# EAGLE design A6SS-4 (EAGLE 7.5.0)

## Sheet 1 of 4: SS-read
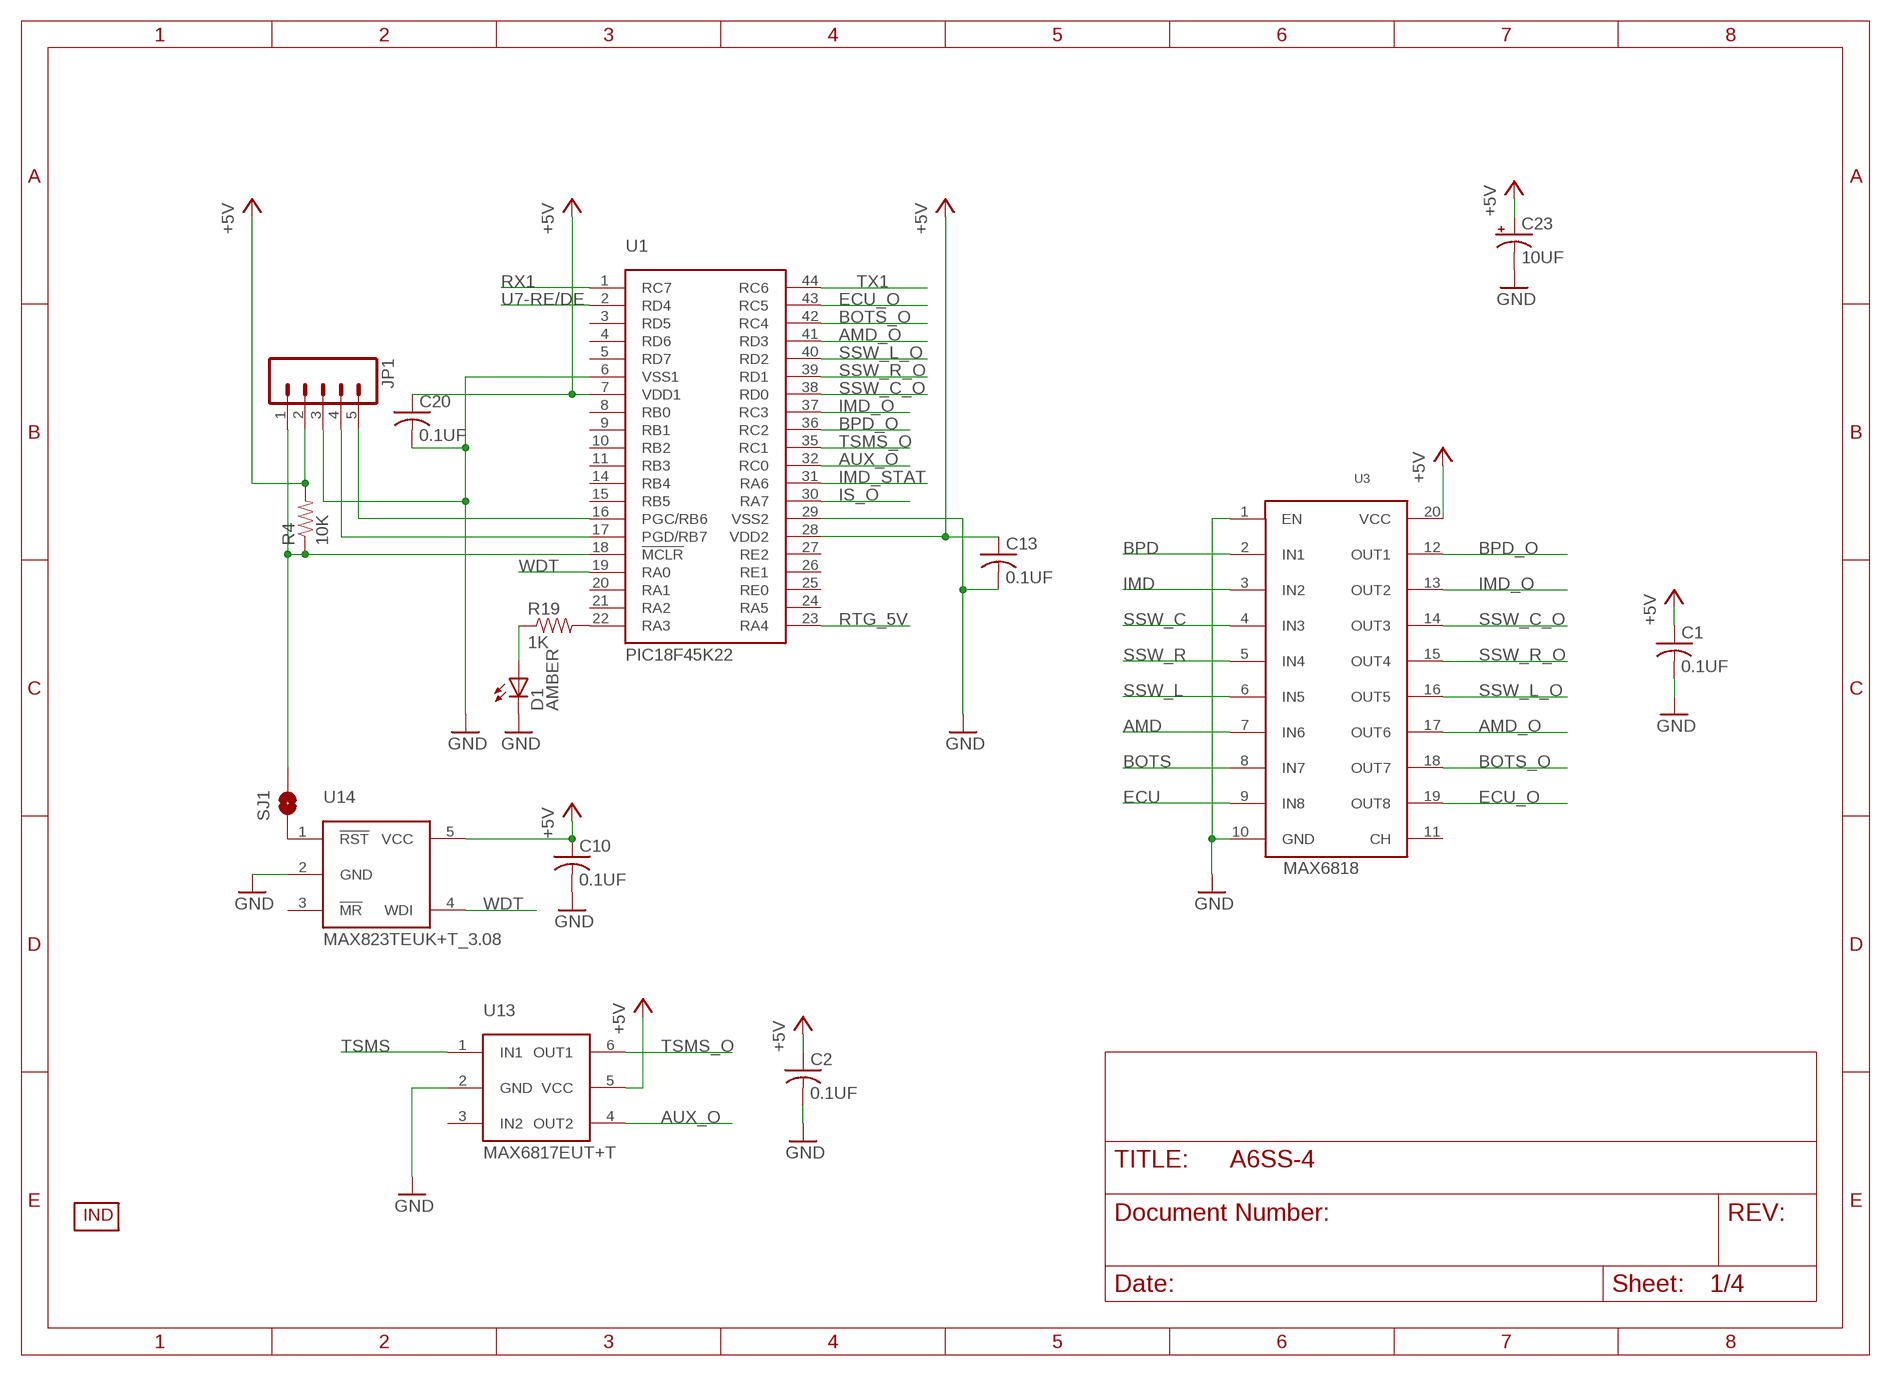
[diagram p0: schematic, sheet 1]

### Parts
C1  0.1UF  CAP_0.1UF_50V_0805  [0805]
C2  0.1UF  CAP_0.1UF_50V_0805  [0805]
C10  0.1UF  CAP_0.1UF_50V_0805  [0805]
C13  0.1UF  CAP_0.1UF_50V_0805  [0805]
C20  0.1UF  CAP_0.1UF_50V_0805  [0805]
C23  10UF  CAP-POL_10UF_16V  [EIA3216-16V]
D1  AMBER  LED_AMBER  [CHIP_LED0805]
JP1  M05LOCK_LONGPADS  [1X05_LOCK_LONGPADS]
R4  10K  RES_10K_1%_0805  [0805]
R19  1K  RES_1K_1%_0805  [0805]
SJ1  SOLDERJUMPERNO  [SJ_2S-NO]
U1  PIC18F45K22  [TQFP-44]
U3  MAX6818  [SSOP-20]
U13  MAX6817EUT+T  [SOT23-6]
U14  MAX823TEUK+T_3.08  [SOT23-5]
U$1  INDPK1  [PICKIT-PIN-1]

### Nets
+5V: C1.1(+) C2.1(+) C10.1(+) C13.1(+) C20.1(+) C23.A(+) JP1.2 R4.2 U1.7(VDD1) U1.28(VDD2) U3.20(VCC) U13.5(VCC) U14.5(VCC) ; also sheet 2,3,4
AMD: U3.7(IN6) ; also sheet 4
AMD_O: U1.41(RD3) U3.17(OUT6)
AUX_O: U1.32(RC0) U13.4(OUT2)
BOTS: U3.8(IN7) ; also sheet 4
BOTS_O: U1.42(RC4) U3.18(OUT7)
BPD: U3.2(IN1) ; also sheet 4
BPD_O: U1.36(RC2) U3.12(OUT1)
ECU: U3.9(IN8) ; also sheet 4
ECU_O: U1.43(RC5) U3.19(OUT8)
GND: C1.2(-) C2.2(-) C10.2(-) C13.2(-) C20.2(-) C23.C(-) D1.C JP1.3 U1.6(VSS1) U1.29(VSS2) U3.1(EN) U3.10(GND) U13.2(GND) U14.2(GND) ; also sheet 2,3,4
IMD: U3.3(IN2) ; also sheet 4
IMD_O: U1.37(RC3) U3.13(OUT2)
IMD_STAT: U1.31(RA6) ; also sheet 3
IS_O: U1.30(RA7) ; also sheet 4
N$1: SJ1.1 U14.1(!RST)
N$16: D1.A R19.1
N$20: R19.2 U1.22(RA3)
N$40: JP1.4 U1.17(PGD/RB7)
N$43: JP1.5 U1.16(PGC/RB6)
N$46: JP1.1 R4.1 SJ1.2 U1.18(!MCLR)
RTG_5V: U1.23(RA4) ; also sheet 2
RX1: U1.1(RC7) ; also sheet 4
SSW_C: U3.4(IN3) ; also sheet 4
SSW_C_O: U1.38(RD0) U3.14(OUT3)
SSW_L: U3.6(IN5) ; also sheet 4
SSW_L_O: U1.40(RD2) U3.16(OUT5)
SSW_R: U3.5(IN4) ; also sheet 4
SSW_R_O: U1.39(RD1) U3.15(OUT4)
TSMS: U13.1(IN1) ; also sheet 4
TSMS_O: U1.35(RC1) U13.6(OUT1)
TX1: U1.44(RC6) ; also sheet 4
U7-RE/DE: U1.2(RD4) ; also sheet 4
WDT: U1.19(RA0) U14.4(WDI)
Unconnected: U1.3(RD5) U1.4(RD6) U1.5(RD7) U1.8(RB0) U1.9(RB1) U1.10(RB2) U1.11(RB3) U1.14(RB4) U1.15(RB5) U1.20(RA1) U1.21(RA2) U1.24(RA5) U1.25(RE0) U1.26(RE1) U1.27(RE2) U3.11(CH) U13.3(IN2) U14.3(!MR)

## Sheet 2 of 4: PRE charge
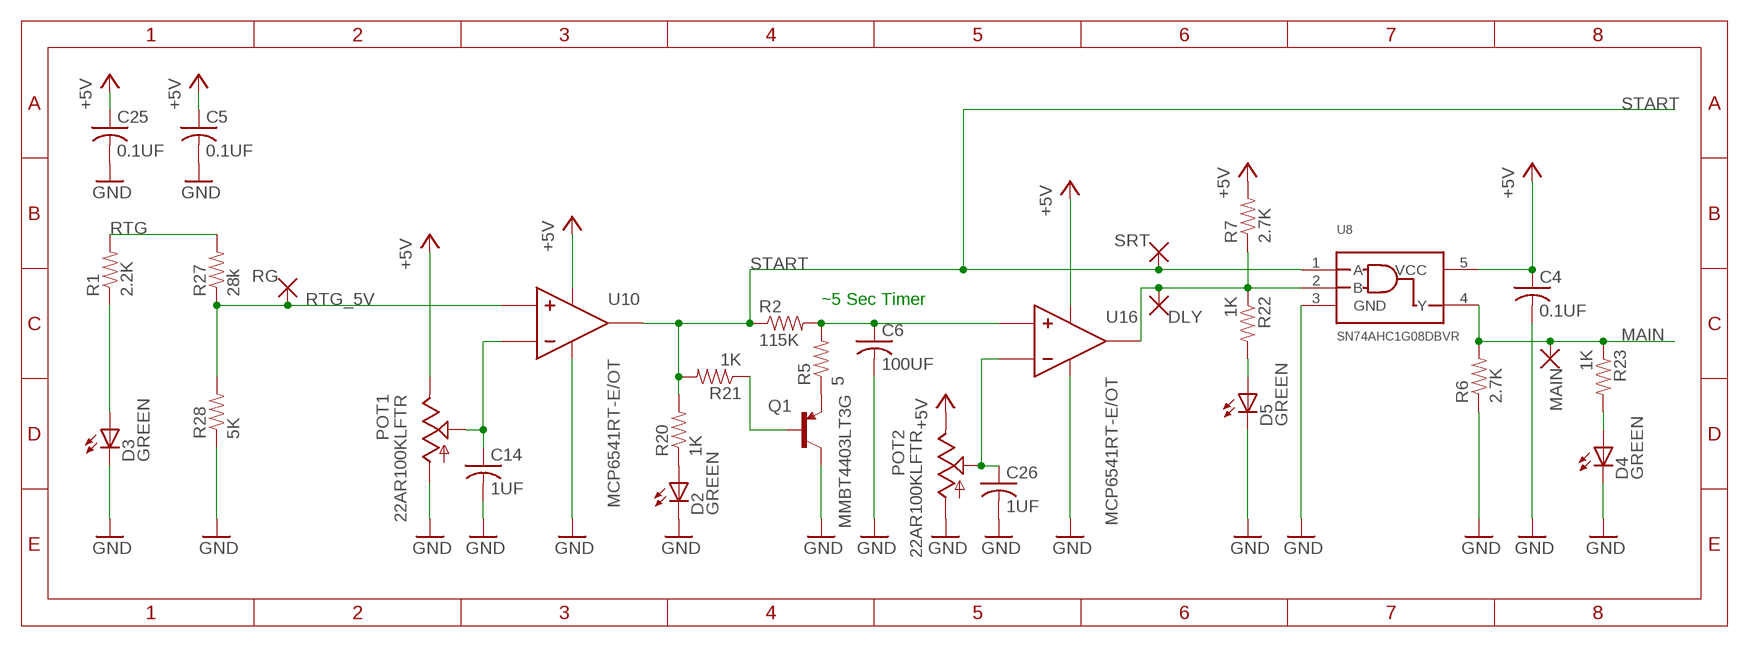
[diagram p1: schematic, sheet 2]

### Parts
C4  0.1UF  CAP_0.1UF_50V_0805  [0805]
C5  0.1UF  CAP_0.1UF_50V_0805  [0805]
C6  100UF  CAP_100UF_6.3V  [1206]
C14  1UF  CAP_1UF_50V_0805  [0805]
C25  0.1UF  CAP_0.1UF_50V_0805  [0805]
C26  1UF  CAP_1UF_50V_0805  [0805]
D2  GREEN  LED_GREEN  [CHIP_LED0805]
D3  GREEN  LED_GREEN  [CHIP_LED0805]
D4  GREEN  LED_GREEN  [CHIP_LED0805]
D5  GREEN  LED_GREEN  [CHIP_LED0805]
DLY  TP  [0603]
MAIN  TP  [0603]
POT1  22AR100KLFTR  [22AR100KLFTR]
POT2  22AR100KLFTR  [22AR100KLFTR]
Q1  MMBT4403LT3G  PNP_MMBT4403LT3G  [SOT23]
R1  2.2K  RES_2.2K_1%_0805  [0805]
R2  115K  RES_115K_1%_0805  [0805]
R5  5  RES_5_5%_0805  [0805]
R6  2.7K  RES_2.7K_5%_0805  [0805]
R7  2.7K  RES_2.7K_5%_0805  [0805]
R20  1K  RES_1K_1%_0805  [0805]
R21  1K  RES_1K_1%_0805  [0805]
R22  1K  RES_1K_1%_0805  [0805]
R23  1K  RES_1K_1%_0805  [0805]
R27  28k  RES_28K_1%  [0805]
R28  5K  RES_5K_0.1%  [0805]
RG  TP  [0603]
SRT  TP  [0603]
U8  SN74AHC1G08DBVR  [SOT23-5]
U10  MCP6541RT-E/OT  [SOT23-5]
U16  MCP6541RT-E/OT  [SOT23-5]

### Nets
+5V: C4.1(+) C5.1(+) C25.1(+) POT1.1(CCW) POT2.1(CCW) R7.2 U8.5(VCC) U10.2(VDD) U16.2(VDD) ; also sheet 1,3,4
GND: C4.2(-) C5.2(-) C6.2(-) C14.2(-) C25.2(-) C26.2(-) D2.C D3.C D4.C D5.C POT1.3(CW) POT2.3(CW) Q1.3(C) R6.1 R28.1 U8.3(GND) U10.5(GND) U16.5(GND) ; also sheet 1,3,4
MAIN: MAIN.1 MAIN.2 R6.2 R23.1 U8.4(Y) ; also sheet 4
N$3: C26.1(+) POT2.2(W) U16.4(-)
N$5: Q1.1(B) R21.1
N$6: Q1.2(E) R5.1
N$11: C14.1(+) POT1.2(W) U10.4(-)
N$27: D2.A R20.1
N$33: D3.A R1.1
N$59: C6.1(+) R2.2 R5.2 U16.3(+)
N$62: DLY.1 DLY.2 R7.1 R22.1 U8.2(B) U16.1(VOUT)
N$63: D4.A R23.2
N$67: D5.A R22.2
RTG: R1.2 R27.2 ; also sheet 4
RTG_5V: R27.1 R28.2 RG.1 RG.2 U10.3(+) ; also sheet 1
START: R2.1 R20.2 R21.2 SRT.1 SRT.2 U8.1(A) U10.1(VOUT) ; also sheet 4

### Notes on the sheet
- ~5 Sec Timer

## Sheet 3 of 4
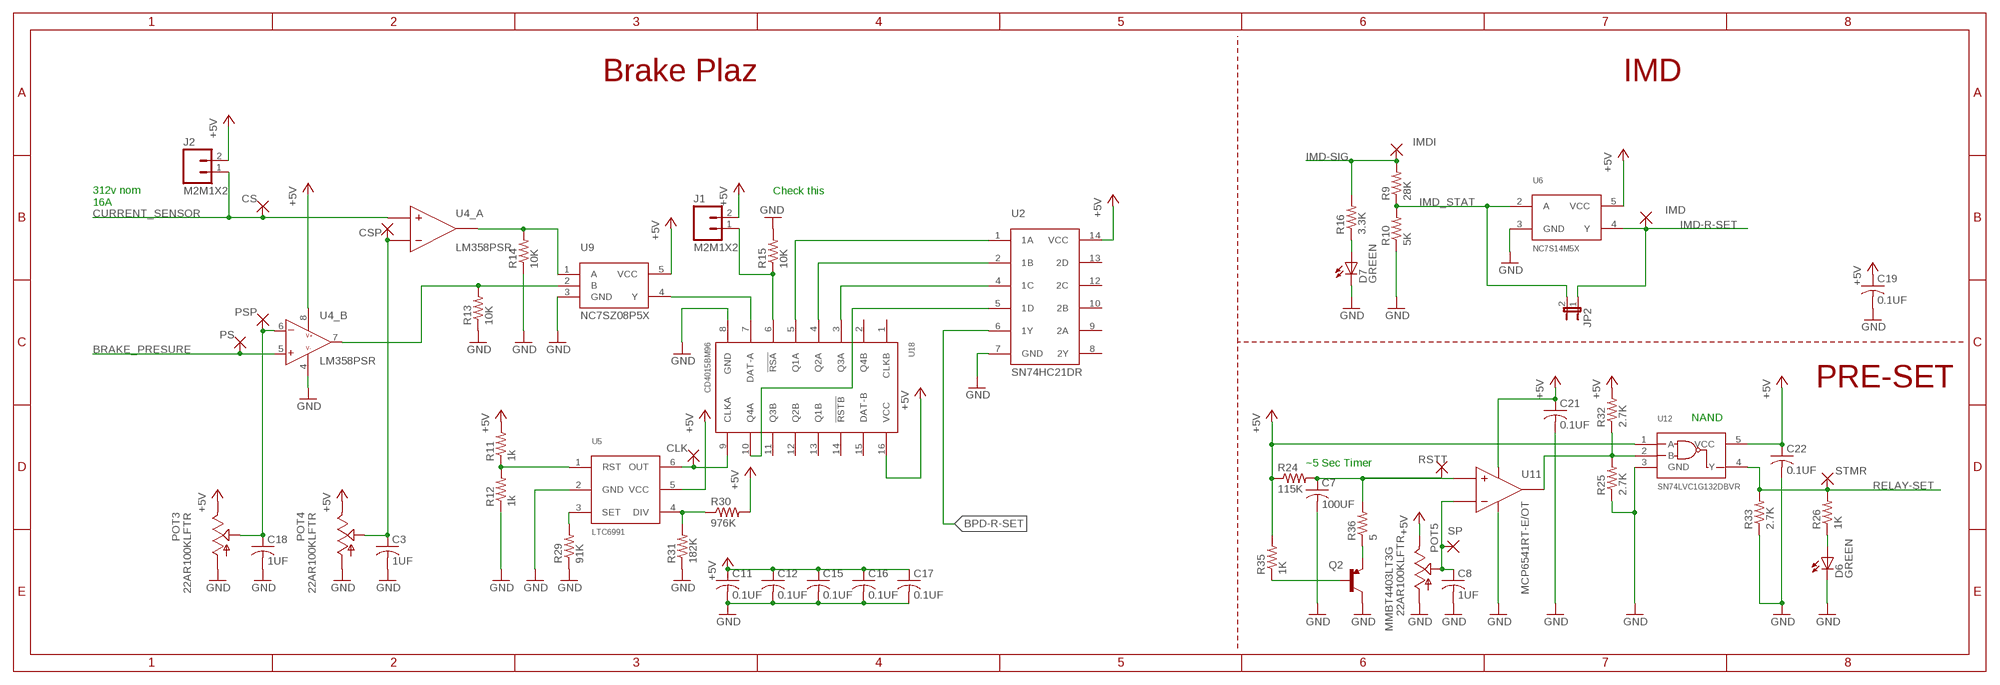
[diagram p2: schematic, sheet 3]

### Parts
C3  1UF  CAP_1UF_50V_0805  [0805]
C7  100UF  CAP_100UF_6.3V  [1206]
C8  1UF  CAP_1UF_50V_0805  [0805]
C11  0.1UF  CAP_0.1UF_50V_0805  [0805]
C12  0.1UF  CAP_0.1UF_50V_0805  [0805]
C15  0.1UF  CAP_0.1UF_50V_0805  [0805]
C16  0.1UF  CAP_0.1UF_50V_0805  [0805]
C17  0.1UF  CAP_0.1UF_50V_0805  [0805]
C18  1UF  CAP_1UF_50V_0805  [0805]
C19  0.1UF  CAP_0.1UF_50V_0805  [0805]
C21  0.1UF  CAP_0.1UF_50V_0805  [0805]
C22  0.1UF  CAP_0.1UF_50V_0805  [0805]
CLK  TP  [0603]
CS  TP  [0603]
CSP  TP  [0603]
D6  GREEN  LED_GREEN  [CHIP_LED0805]
D7  GREEN  LED_GREEN  [CHIP_LED0805]
IMD  TP  [0603]
IMDI  TP  [0603]
J1  M2M1X2  [MOLEX-1X2]
J2  M2M1X2  [MOLEX-1X2]
JP2  JUMPER-2SMD-NO  [SJ_2S-NO]
POT3  22AR100KLFTR  [22AR100KLFTR]
POT4  22AR100KLFTR  [22AR100KLFTR]
POT5  22AR100KLFTR  [22AR100KLFTR]
PS  TP  [0603]
PSP  TP  [0603]
Q2  MMBT4403LT3G  PNP_MMBT4403LT3G  [SOT23]
R9  28K  RES_28K_1%  [0805]
R10  5K  RES_5K_0.1%  [0805]
R11  1k  RES_1K_1%_0805  [0805]
R12  1k  RES_1K_1%_0805  [0805]
R13  10K  RES_10K_1%_0805  [0805]
R14  10K  RES_10K_1%_0805  [0805]
R15  10K  RES_10K_1%_0805  [0805]
R16  3.3K  RES_3.3K_1%_0805  [0805]
R24  115K  RES_115K_1%_0805  [0805]
R25  2.7K  RES_2.7K_5%_0805  [0805]
R26  1K  RES_1K_1%_0805  [0805]
R29  91K  RES_91K_1%_0805  [0805]
R30  976K  RES_976K_0.1%  [0805]
R31  182K  RES_182K_0.1%  [0805]
R32  2.7K  RES_2.7K_5%_0805  [0805]
R33  2.7K  RES_2.7K_5%_0805  [0805]
R35  1K  RES_1K_1%_0805  [0805]
R36  5  RES_5_5%_0805  [0805]
RSTT  TP  [0603]
SP  TP  [0603]
STMR  TP  [0603]
U2  SN74HC21DR  [SO-14]
U4  LM358PSR  [SO-8]
U5  LTC6991  [TSOT-23-6]
U6  NC7S14M5X  [SOT23-5]
U9  NC7SZ08P5X  [SC-70-5]
U11  MCP6541RT-E/OT  [SOT23-5]
U12  SN74LVC1G132DBVR  [SOT23-5]
U18  CD4015BM96  [SO-16]

### Nets
+5V: C11.1(+) C12.1(+) C15.1(+) C16.1(+) C17.1(+) C19.1(+) C21.1(+) C22.1(+) J1.2 J2.2 POT3.1(CCW) POT4.1(CCW) POT5.1(CCW) R11.2 R24.1 R30.2 R32.2 R35.2 U2.14(VCC) U4.8(_B:V+) U5.5(VCC) U6.5(VCC) U9.5(VCC) U11.2(VDD) U12.1(A) U12.5(VCC) U18.16(VCC) ; also sheet 1,2,4
BPD-R-SET: U2.6(1Y) ; also sheet 4
BRAKE_PRESURE: PS.1 PS.2 U4.5(_B:+) ; also sheet 4
CURRENT_SENSOR: CS.1 CS.2 J2.1 U4.3(_A:+) ; also sheet 4
GND: C3.2(-) C7.2(-) C8.2(-) C11.2(-) C12.2(-) C15.2(-) C16.2(-) C17.2(-) C18.2(-) C19.2(-) C21.2(-) C22.2(-) D6.C D7.C POT3.3(CW) POT4.3(CW) POT5.3(CW) Q2.3(C) R10.1 R12.1 R13.1 R14.1 R15.2 R25.1 R29.1 R31.1 R33.1 U2.7(GND) U4.4(_B:V-) U5.2(GND) U6.3(GND) U9.3(GND) U11.5(GND) U12.3(GND) U18.8(GND) ; also sheet 1,2,4
IMD-R-SET: IMD.1 IMD.2 JP2.1 U6.4(Y) ; also sheet 4
IMD-SIG: IMDI.1 IMDI.2 R9.2 R16.2 ; also sheet 4
IMD_STAT: JP2.2 R9.1 R10.2 U6.2(A) ; also sheet 1
N$4: C8.1(+) POT5.2(W) SP.1 SP.2 U11.4(-)
N$7: U2.5(1D) U18.10(Q4A)
N$10: R30.1 R31.2 U5.4(DIV)
N$12: D7.A R16.1
N$13: U9.4(Y) U18.7(DAT-A)
N$14: J1.1 R15.1 U18.6(!RSA)
N$17: U2.1(1A) U18.5(Q1A)
N$18: U2.2(1B) U18.4(Q2A)
N$19: U2.4(1C) U18.3(Q3A)
N$21: R29.2 U5.3(SET)
N$22: CLK.1 CLK.2 U5.6(OUT) U18.9(CLKA)
N$23: C3.1(+) CSP.1 CSP.2 POT4.2(W) U4.2(_A:-)
N$24: R25.2 R32.1 U11.1(VOUT) U12.2(B)
N$25: R11.1 R12.2 U5.1(RST)
N$26: C18.1(+) POT3.2(W) PSP.1 PSP.2 U4.6(_B:-)
N$28: R14.2 U4.1(_A:VOUT) U9.1(A)
N$29: D6.A R26.1
N$30: R13.2 U4.7(_B:O) U9.2(B)
N$31: Q2.1(B) R35.1
N$32: Q2.2(E) R36.1
N$34: C7.1(+) R24.2 R36.2 RSTT.1 RSTT.2 U11.3(+)
RELAY-SET: R26.2 R33.2 STMR.1 STMR.2 U12.4(Y) ; also sheet 4
Unconnected: U2.8(2Y) U2.9(2A) U2.10(2B) U2.12(2C) U2.13(2D) U18.1(CLKB) U18.2(Q4B) U18.11(Q3B) U18.12(Q2B) U18.13(Q1B) U18.14(!RSTB) U18.15(DAT-B)

### Notes on the sheet
- Brake Plaz | IMD
- Check this
- 312v nom
  16A
- PRE-SET
- NAND
- ~5 Sec Timer

## Sheet 4 of 4
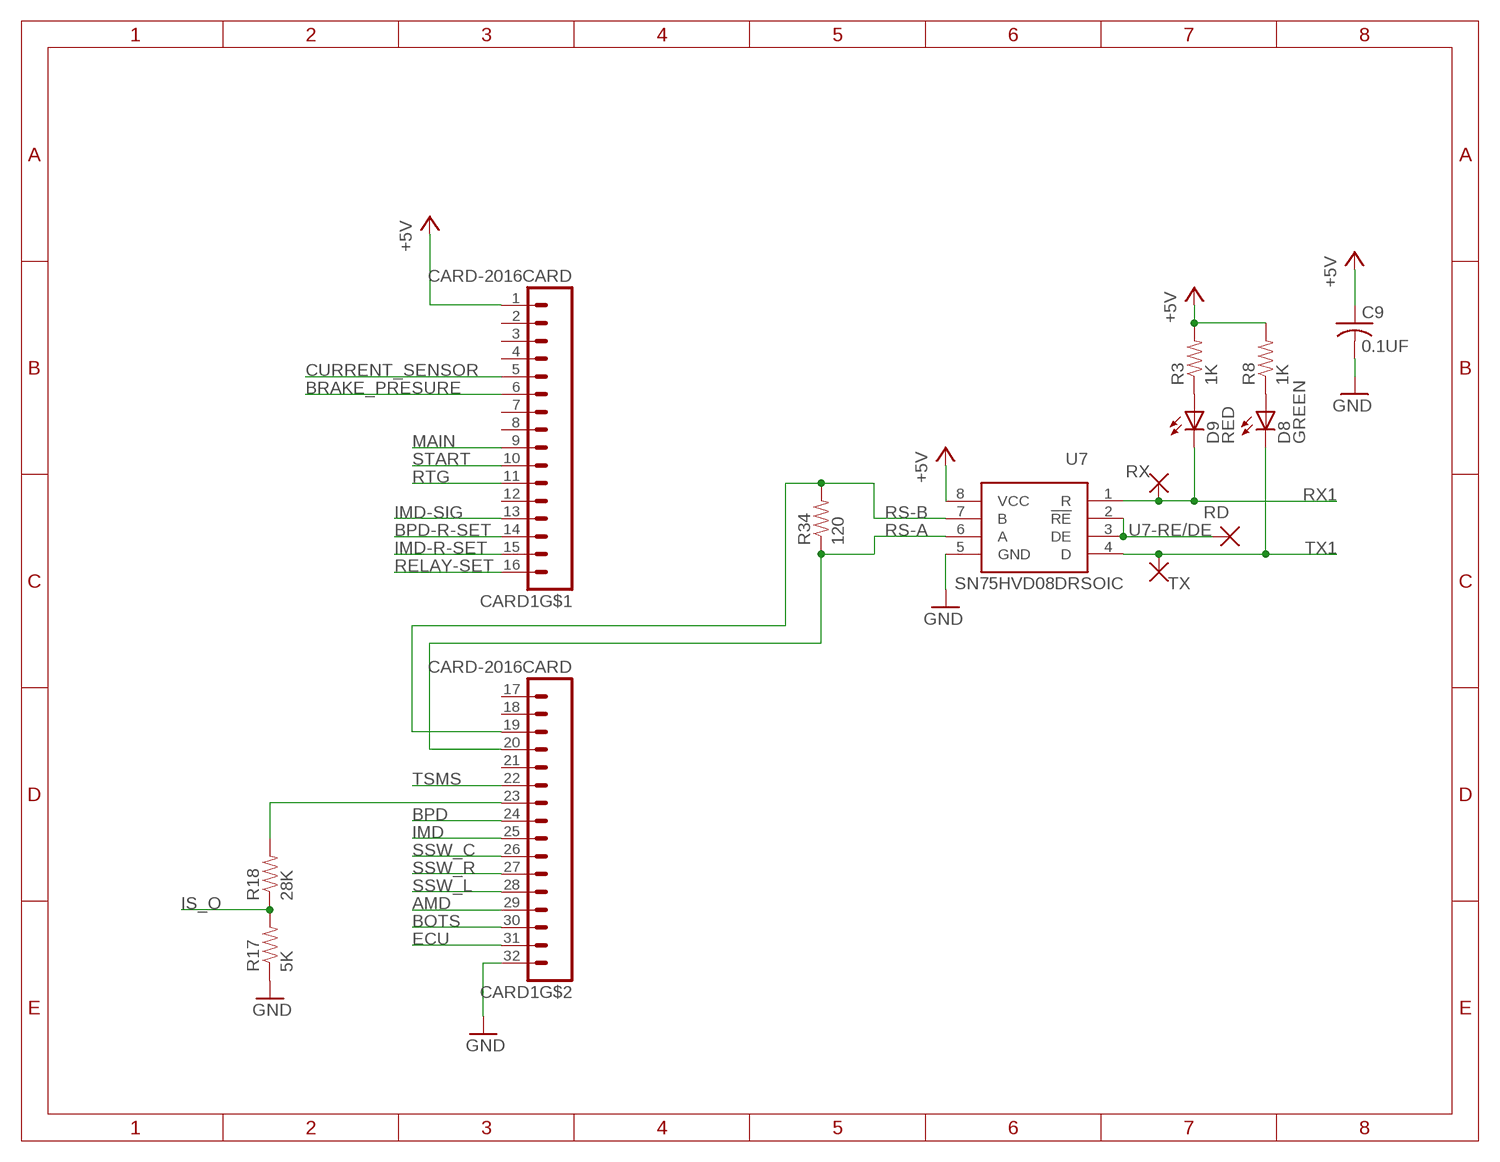
[diagram p3: schematic, sheet 4]

### Parts
C9  0.1UF  CAP_0.1UF_50V_0805  [0805]
CARD1  CARD-2016CARD  [CARD-2016]
D8  GREEN  LED_GREEN  [CHIP_LED0805]
D9  RED  LED_RED  [CHIP_LED0805]
R3  1K  RES_1K_1%_0805  [0805]
R8  1K  RES_1K_1%_0805  [0805]
R17  5K  RES_5K_0.1%  [0805]
R18  28K  RES_28K_1%  [0805]
R34  120  RES_120_1%_0805  [0805]
RD  TP  [0603]
RX  TP  [0603]
TX  TP  [0603]
U7  SN75HVD08DRSOIC  [SO-8]

### Nets
+5V: C9.1(+) CARD1.1 R3.2 R8.2 U7.8(VCC) ; also sheet 1,2,3
AMD: CARD1.29 ; also sheet 1
BOTS: CARD1.30 ; also sheet 1
BPD: CARD1.24 ; also sheet 1
BPD-R-SET: CARD1.14 ; also sheet 3
BRAKE_PRESURE: CARD1.6 ; also sheet 3
CURRENT_SENSOR: CARD1.5 ; also sheet 3
ECU: CARD1.31 ; also sheet 1
GND: C9.2(-) CARD1.32 R17.1 U7.5(GND) ; also sheet 1,2,3
IMD: CARD1.25 ; also sheet 1
IMD-R-SET: CARD1.15 ; also sheet 3
IMD-SIG: CARD1.13 ; also sheet 3
IS_O: R17.2 R18.1 ; also sheet 1
MAIN: CARD1.9 ; also sheet 2
N$2: CARD1.23 R18.2
N$8: D9.A R3.1
N$9: D8.A R8.1
RELAY-SET: CARD1.16 ; also sheet 3
RS-A: CARD1.20 R34.1 U7.6(A)
RS-B: CARD1.19 R34.2 U7.7(B)
RTG: CARD1.11 ; also sheet 2
RX1: D9.C RX.1 RX.2 U7.1(R) ; also sheet 1
SSW_C: CARD1.26 ; also sheet 1
SSW_L: CARD1.28 ; also sheet 1
SSW_R: CARD1.27 ; also sheet 1
START: CARD1.10 ; also sheet 2
TSMS: CARD1.22 ; also sheet 1
TX1: D8.C TX.1 TX.2 U7.4(D) ; also sheet 1
U7-RE/DE: RD.1 RD.2 U7.2(!RE) U7.3(DE) ; also sheet 1
Unconnected: CARD1.2 CARD1.3 CARD1.4 CARD1.7 CARD1.8 CARD1.12 CARD1.17 CARD1.18 CARD1.21

## Library data of the parts
C1 C2 C4 C5 C9-C13 C15-C17 C19-C22 C25 = FSAE Electric:CAP; PARTNO: CC0805ZRY5V9BB104
C3 C8 C14 C18 C26 = FSAE Electric:CAP; PARTNO: UMK212F105ZG-T
C6 C7 = FSAE Electric:CAP; PARTNO: GRM31CR60J107ME39K
C23 = FSAE Electric:CAP-POL; PARTNO: T491A106M016AT
CARD1 = FSAE Electric:CARD-2016
CLK CS CSP DLY IMD IMDI MAIN PS PSP RD RG RSTT RX SP SRT STMR TX = FSAE Electric:TP: SMD test points to make life easy to test / debug; PARTNO: 1625854-3
D1 = FSAE Electric:LED; PARTNO: HSMA-C170
D2-D8 = FSAE Electric:LED; PARTNO: LTST-S220GKT
D9 = FSAE Electric:LED; PARTNO: LH R974-LP-1
J1 J2 = FSAE Electric:M2; PARTNO: 0022232021
JP1 = SparkFun-Connectors:M05: Header 5 Standard 5-pin 0.1" header. Use with straight break away headers (SKU : PRT-00116), right angle break away headers (PRT-00553), swiss pins (PRT-00743), machine pins (PRT-00117), and female headers (PRT-00115). Molex polarized connector foot print use with SKU : PRT-08230 with associated crimp pins and housings.
JP2 = SparkFun-Passives:JUMPER-2: Jumper Basic 0.1" spaced jumper. Use with breakaway headers.
POT1-POT5 = FSAE Eletric:22AR100KLFTR; PARTNO: 22AR100KLFTR
Q1 Q2 = FSAE Electric:PNP; PARTNO: MMBT4403LT3G
R1 = FSAE Electric:RES: Resistors; PARTNO: RC0805FR-072K2L
R2 R24 = FSAE Electric:RES: Resistors; PARTNO: RC0805FR-07115KL
R3 R8 R11 R12 R19-R23 R26 R35 = FSAE Electric:RES: Resistors; PARTNO: RC0805FR-071KL
R4 R13-R15 = FSAE Electric:RES: Resistors; PARTNO: RC0805FR-0710KL
R5 R36 = FSAE Electric:RES: Resistors; PARTNO: RC0805JR-075R1L
R6 R7 R25 R32 R33 = FSAE Electric:RES: Resistors; PARTNO: RC0805JR-072K7L
R9 R18 R27 = FSAE Electric:RES: Resistors; PARTNO: RC0805FR-0728KL
R10 R17 R28 = FSAE Electric:RES: Resistors; PARTNO: PNM0805E5001BST5
R16 = FSAE Electric:RES: Resistors; PARTNO: RC0805FR-073K3L
R29 = FSAE Electric:RES: Resistors; PARTNO: ERJ-6ENF9102V
R30 = FSAE Electric:RES: Resistors; PARTNO: ERA-6AEB9763V
R31 = FSAE Electric:RES: Resistors; PARTNO: ERA-6AEB1823V
R34 = FSAE Electric:RES: Resistors; PARTNO: RC0805FR-07120RL
SJ1 = SparkFun-Passives:SOLDERJUMPER: Solder Jumper Standard SMD solder jumper. Used to automate production. Two varients : Normally Open and Normally Closed are the same, but have different paste layers. NC will have a large amount of paste and should jumper during reflow.
U1 = FSAE Electric:PIC18F45K22: Microprocessor used in many places on the car View on DigiKey <http://www.digikey.com/product-detail/en/PIC18F45K22T-I%2FPT/PIC18F45K22T-I%2FPTCT-ND/5169582>; PARTNO: PIC18F45K22T-I/PT
U2 = FSAE Electric:SN74HC21DR; PARTNO: SN74HC21DR
U3 = FSAE Electric:MAX6818; PARTNO: MAX6818EAP+
U4 = FSAE Electric:LM358; PARTNO: LM358PSR
U5 = FSAE Electric:LTC6991: Low Frequency Oscillator -Period Range: 1ms to 9.5 Hours -Configured with 1 to 3 Resistors -1.5% Maximum Frequency Error -Output Reset Function -2.25V to 5.5V Single Supply Operation -55μA to 80μA Supply Current -(2ms to 9.5hr Clock Period) -500μs Start-Up Time -CMOS Output Driver Sources/Sinks 20mA; PARTNO: LTC6991HS6#TRMPBF
U6 = FSAE Electric:NC7S14M5X; PARTNO: NC7S14M5X
U7 = FSAE Electric:SN75HVD08DR: RS485 Transceiver View on DigiKey <http://www.digikey.com/product-detail/en/SN75HVD08DR/296-37893-1-ND/4899996>; PARTNO: SN75HVD08DR
U8 = FSAE Electric:SN74AHC1G08DBVR: AND gate; PARTNO: SN74AHC1G08DBVR
U9 = FSAE Electric:NC7SZ08P5X; PARTNO: NC7SZ08P5X
U10 U11 U16 = FSAE Electric:MCP6541; PARTNO: MCP6541RT-E/OT
U12 = FSAE Electric:SN74LVC1G132DBVR; PARTNO: SN74LVC1G132DBVR
U13 = FSAE Electric:MAX6817; PARTNO: MAX6817EUT+T
U14 = FSAE Electric:MAX823: IC SUPERV MPU CIRC SOT-23-5; PARTNO: MAX823TEUK+T
U18 = FSAE Electric:CD4015BM96; PARTNO: CD4015BM96
U$1 = FSAE Eletric (2):IND

## Board
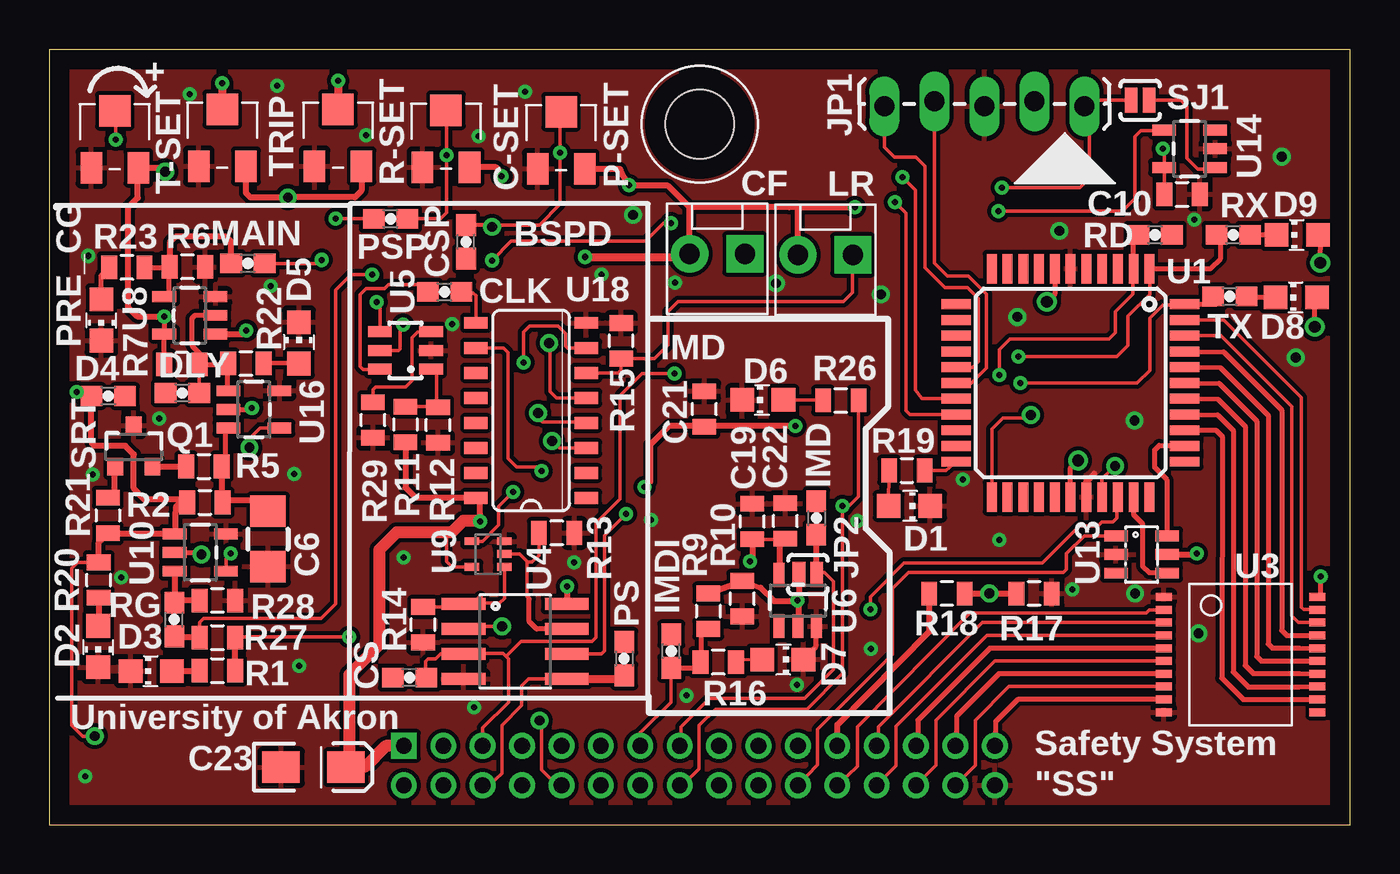
[diagram p4: board, top side]
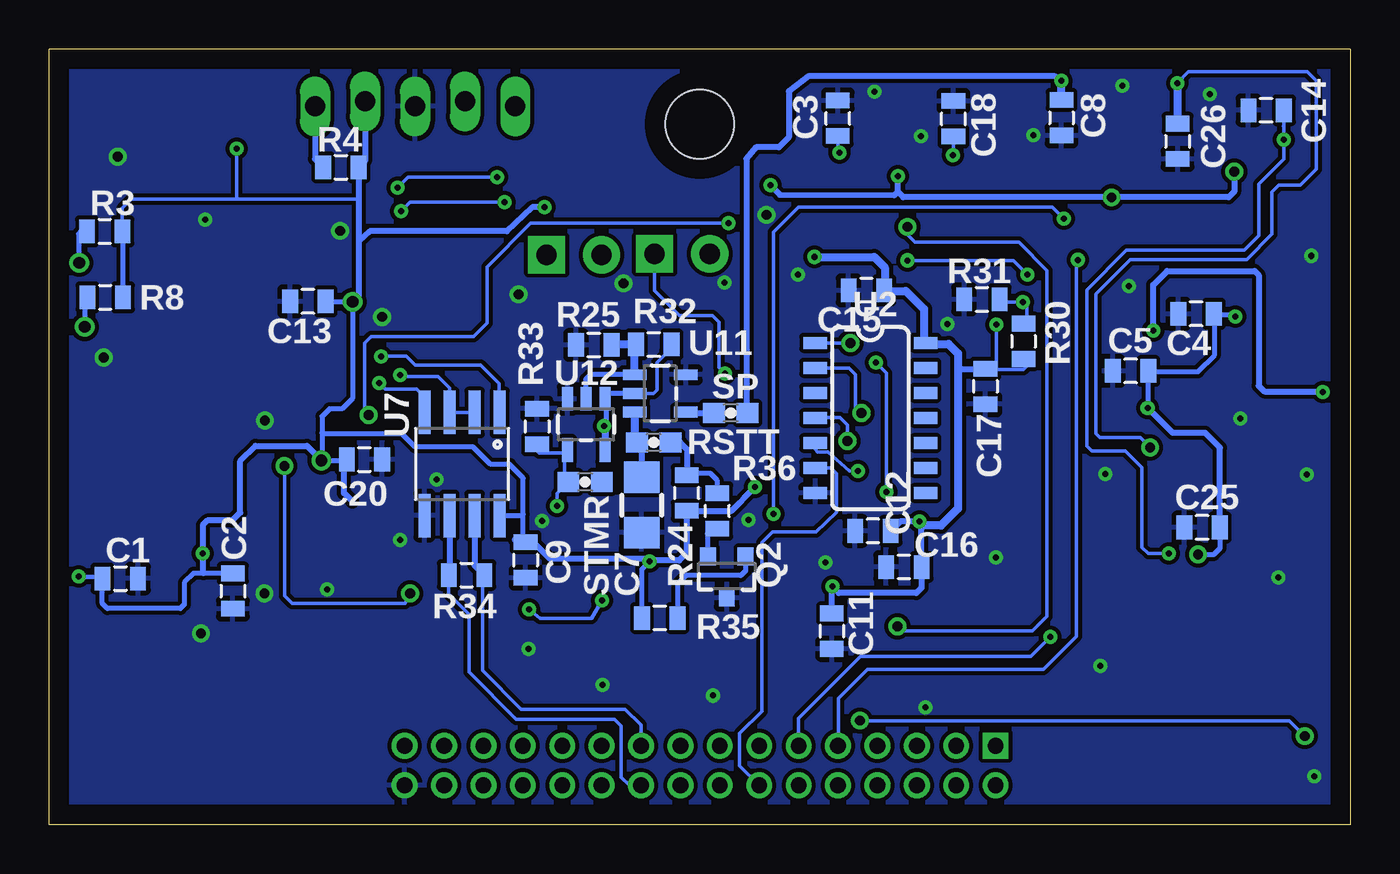
[diagram p5: board, bottom side, seen from below]

Size 66.04 x 39.37 mm. Coordinates in mm from the lower left corner, seen from the top.
Copper layers (1*16): Top 0.035mm / dielectric 1.5mm / Bottom 0.035mm
Design rules "default *": minimum track width 7mil, minimum drill 12mil, track to track 8mil, track to pad 8mil, pad to pad 8mil, via to via 8mil, smd to smd 8mil, copper to edge 40mil, drill to drill 8mil, minimum pad ring 10mil, minimum via ring 8mil, stop-mask expansion 4mil, vias tented up to drill 0mil, thermal gap 10mil

### Footprints (pad centres in the part's own frame; a part is rotated, then mirrored left to right if it is on the bottom)
0805 = smd 0.8 x 1.2: 1 -0.9,0; 2 0.9,0
1206 = smd 1.6 x 1.8: 1 -1.4,0; 2 1.4,0
EIA3216-16V = smd 1.9 x 1.6: A 1.65,0; C -1.65,0
CARD-2016 = drill 0.8 square: 1 18,4 | drill 0.8: 2 18,2; 3 20,4; 4 20,2; 5 22,4; 6 22,2; 7 24,4; 8 24,2; 9 26,4; 10 26,2; 11 28,4; 12 28,2; 13 30,4; 14 30,2; 15 32,4; 16 32,2; 17 34,4; 18 34,2; 19 36,4; 20 36,2; 21 38,4; 22 38,2; 23 40,4; 24 40,2; 25 42,4; 26 42,2; 27 44,4; 28 44,2; 29 46,4; 30 46,2; 31 48,4; 32 48,2 | hole 3.5: 33.02,35.56
0603 = smd 1.1 x 1: 1 -0.85,0; 2 0.85,0
CHIP_LED0805 = smd 1.2 x 1.2: A 0,-1.05; C 0,1.05
MOLEX-1X2 = drill 1.016 pad 1.88 square: 1 -1.397,0 | drill 1.016 pad 1.88: 2 1.397,0
1X05_LOCK_LONGPADS = drill 1.016 long: 1 0,0; 2 2.54,-0.254; 3 5.08,0; 4 7.62,-0.254; 5 10.16,0
SJ_2S-NO = smd 0.635 x 1.27: 1 -0.45,0; 2 0.45,0
22AR100KLFTR = smd 1.092 x 1.6: 1 1.194,-1.448; 3 -1.194,-1.448 | smd 1.6 x 1.6: 2 0,1.448
SOT23 = smd 0.8 x 0.9: 1 -0.95,-1; 2 0.95,-1; 3 0,1.1
TQFP-44 = smd 1.5 x 0.5: 1 -5.8,4; 2 -5.8,3.2; 3 -5.8,2.4; 4 -5.8,1.6; 5 -5.8,0.8; 6 -5.8,0; 7 -5.8,-0.8; 8 -5.8,-1.6; 9 -5.8,-2.4; 10 -5.8,-3.2; 11 -5.8,-4; 23 5.8,-4; 24 5.8,-3.2; 25 5.8,-2.4; 26 5.8,-1.6; 27 5.8,-0.8; 28 5.8,0; 29 5.8,0.8; 30 5.8,1.6; 31 5.8,2.4; 32 5.8,3.2; 33 5.8,4 | smd 0.5 x 1.5: 12 -4,-5.8; 13 -3.2,-5.8; 14 -2.4,-5.8; 15 -1.6,-5.8; 16 -0.8,-5.8; 17 0,-5.8; 18 0.8,-5.8; 19 1.6,-5.8; 20 2.4,-5.8; 21 3.2,-5.8; 22 4,-5.8; 34 4,5.8; 35 3.2,5.8; 36 2.4,5.8; 37 1.6,5.8; 38 0.8,5.8; 39 0,5.8; 40 -0.8,5.8; 41 -1.6,5.8; 42 -2.4,5.8; 43 -3.2,5.8; 44 -4,5.8
SO-14 = smd 0.6 x 1.2: 1 -3.81,-2.8; 2 -2.54,-2.8; 3 -1.27,-2.8; 4 0,-2.8; 5 1.27,-2.8; 6 2.54,-2.8; 7 3.81,-2.8; 8 3.81,2.8; 9 2.54,2.8; 10 1.27,2.8; 11 0,2.8; 12 -1.27,2.8; 13 -2.54,2.8; 14 -3.81,2.8
SSOP-20 = smd 0.813 x 0.406: 1 -3.9,2.925; 2 -3.9,2.275; 3 -3.9,1.625; 4 -3.9,0.975; 5 -3.9,0.325; 6 -3.9,-0.325; 7 -3.9,-0.975; 8 -3.9,-1.625; 9 -3.9,-2.275; 10 -3.9,-2.925; 11 3.9,-2.925; 12 3.9,-2.275; 13 3.9,-1.625; 14 3.9,-0.975; 15 3.9,-0.325; 16 3.9,0.325; 17 3.9,0.975; 18 3.9,1.625; 19 3.9,2.275; 20 3.9,2.925
SO-8 = smd 0.61 x 2.21: 1 -1.905,-2.616; 2 -0.635,-2.616; 3 0.635,-2.616; 4 1.905,-2.616; 5 1.905,2.616; 6 0.635,2.616; 7 -0.635,2.616; 8 -1.905,2.616
TSOT-23-6 = smd 0.55 x 1.2: 1 -0.95,-1.3; 2 0,-1.3; 3 0.95,-1.3; 4 0.95,1.3; 5 0,1.3; 6 -0.95,1.3
SOT23-5 = smd 0.55 x 1.2: 1 -0.95,-1.3; 2 0,-1.3; 3 0.95,-1.3; 4 0.95,1.3; 5 -0.95,1.3
SC-70-5 = smd 0.4 x 0.75: 1 -0.65,-0.825; 2 0,-0.825; 3 0.65,-0.825; 4 0.65,0.825; 5 -0.65,0.825
SOT23-6 = smd 0.55 x 1.2: 1 -0.95,-1.3; 2 0,-1.3; 3 0.95,-1.3; 4 0.95,1.3; 5 0,1.3; 6 -0.95,1.3
SO-16 = smd 0.6 x 1.2: 1 -4.445,-2.8; 2 -3.175,-2.8; 3 -1.905,-2.8; 4 -0.635,-2.8; 5 0.635,-2.8; 6 1.905,-2.8; 7 3.175,-2.8; 8 4.445,-2.8; 9 4.445,2.8; 10 3.175,2.8; 11 1.905,2.8; 12 0.635,2.8; 13 -0.635,2.8; 14 -1.905,2.8; 15 -3.175,2.8; 16 -4.445,2.8

### Placement (x,y rotation side)
C1  62.43,12.5 0 bottom
C2  56.72,11.86 270 bottom
C3  26.01,35.86 90 bottom
C4  7.82,25.93 180 bottom
C5  11.15,23.04 180 bottom
C6  11.1,14.5 270 top
C7  35.97,16.23 270 bottom
C8  14.66,35.89 270 bottom
C9  41.86,13.44 270 bottom
C10  57.51,32 0 top
C11  26.31,9.83 270 bottom
C12  22.66,13.08 180 bottom
C13  52.91,26.57 180 bottom
C14  4.27,36.27 180 bottom
C15  24.56,27.13 180 bottom
C16  24.23,14.91 180 bottom
C17  18.52,22.25 270 bottom
C18  20.14,35.84 90 bottom
C19  35.69,15.39 90 top
C20  50.04,18.54 0 bottom
C21  33.25,21.11 90 top
C22  37.36,15.42 90 top
C23  13.41,2.92 0 top
C25  7.52,15.09 180 bottom
C26  8.76,34.7 270 bottom
CARD1  0,0 0 top
CLK  20.07,27.05 0 top
CS  18.29,7.47 180 top
CSP  21.16,29.59 90 top
D1  43.66,16.18 270 top
D2  2.49,9.04 180 top
D3  5.18,7.8 90 top
D4  2.64,25.63 180 top
D5  12.67,24.46 0 top
D6  36.22,21.56 90 top
D7  37.24,8.38 270 top
D8  63.3,26.77 90 top
D9  63.35,29.95 90 top
DLY  6.76,21.92 0 top
IMD  38.94,15.57 270 top
IMDI  31.57,8.81 90 top
J1  39.4,28.93 180 top
J2  33.91,28.98 180 top
JP1  52.55,36.47 180 top
JP2  38.51,12.7 180 top
MAIN  10.08,28.5 180 top
POT1  3.33,34.8 0 top
POT2  8.79,34.87 0 top
POT3  20.14,34.82 0 top
POT4  25.98,34.75 0 top
POT5  14.66,34.87 0 top
PS  29.18,8.43 270 top
PSP  17.32,30.76 0 top
Q1  4.29,19.18 0 top
Q2  31.65,12.62 180 bottom
R1  8.53,7.82 0 top
R2  7.9,16.36 0 top
R3  63.22,30.12 0 bottom
R4  51.23,33.38 0 bottom
R5  7.85,18.19 0 top
R6  7.01,28.32 180 top
R7  6.73,23.37 180 top
R8  63.2,26.77 0 bottom
R9  33.45,10.85 270 top
R10  35.18,11.48 90 top
R11  18.08,20.32 270 top
R12  19.74,20.29 90 top
R13  25.76,14.81 180 top
R14  18.97,10.16 90 top
R15  29.03,24.56 90 top
R16  33.96,8.25 180 top
R17  49.99,11.73 180 top
R18  45.57,11.73 180 top
R19  43.54,17.98 0 top
R20  2.51,12.42 90 top
R21  2.97,15.7 270 top
R22  9.98,23.42 0 top
R23  3.94,28.3 180 top
R24  33.68,16.84 90 bottom
R25  38.4,24.36 0 bottom
R26  40.18,21.54 0 top
R27  8.53,9.5 0 top
R28  8.53,11.38 180 top
R29  16.43,20.55 90 top
R30  16.59,24.54 270 bottom
R31  18.69,26.67 0 bottom
R32  35.36,24.38 0 bottom
R33  41.27,20.22 270 bottom
R34  44.86,12.67 0 bottom
R35  35.05,10.49 180 bottom
R36  32.13,15.93 90 bottom
RD  56.13,29.95 0 top
RG  6.35,10.41 90 top
RSTT  35.36,19.41 180 bottom
RX  60.1,29.95 0 top
SJ1  55.37,36.78 180 top
SP  31.45,20.9 180 bottom
SRT  3,21.77 0 top
STMR  38.84,17.4 180 bottom
TX  59.92,26.82 0 top
U1  51.84,22.43 270 top
U2  24.36,20.65 270 bottom
U3  60.48,8.64 0 top
U4  23.65,9.3 270 top
U5  18.08,24.08 90 top
U6  38,11.38 0 top
U7  45.09,18.31 180 bottom
U8  7.14,25.86 90 top
U9  22.28,13.74 90 top
U10  7.67,13.82 270 top
U11  35.03,21.89 270 bottom
U12  38.79,20.32 180 bottom
U13  55.45,13.72 270 top
U14  57.89,34.32 90 top
U16  10.39,21.08 270 top
U18  24.46,21.03 90 top
U$1  51.56,35.1 180 top

### Tracks (layer width: path | path; a pad name or v marks a point on that pad's centre or on a via)
+5V  (via drill 0.3, 0.5, 0.6)
  Top 0.178: C19.1 37.34,14.49 C22.1 | U14.5 56.61,33.35 C10.1 56.61,34.22 v56.52,34.32 | 32.33,28.8 32.33,28.85 32.56,29.08 32.56,31.34 32.51,31.39 37.44,31.39 37.57,31.34 | U5.5 17.73,24.08 17.81,24.16 17.81,25.3 v17.96,25.4 | U9.5 20.44,13.09 20.17,13.36 20.17,14.78 20.09,14.86
  Top 0.254: U1.7 51.04,26.94 v50.65,26.54 | U1.28 51.84,18.11 v52.22,18.49 | U3.20 64.56,11.62 v64.54,12.6 | U10.2 7.62,13.82 v7.72,13.72 | R7.2 U8.5 v5.84,25.81 | U16.2 10.21,21.08 v10.29,21.16
  Top 0.305: R11.2 18.08,17.12 18.59,16.61 21.63,16.61 U18.16 21.88,16.37 v21.88,15.39 | v5.89,33.15 5.69,33.35 POT1.1 4.5,33.32 4.5,31.83 3.99,31.32 3.99,26.29 4.47,25.81 v5.84,25.81 | POT5.1 15.85,32.18 15.52,31.85 v12.12,31.85 10.21,31.85 9.98,32.08 POT2.1 | C22.1 37.28,14.52 37.06,14.3 37.06,12.69 U6.5 | C19.1 35.69,13.49 v35.56,13.36 | v37.87,20.24 33.32,20.24 | 33.32,20.24 31.47,20.24 30.51,19.28 30.51,17.42 v30.23,17.15 | C21.1 33.29,20.21 33.32,20.24 | v22.96,32.92 22.96,33.1 22.68,33.38 POT3.1 | POT4.1 28.96,33.3 29.08,32.99 v29.44,32.46 29.39,32.44 31.42,32.44 32.51,31.34 32.51,31.22 | 32.51,31.22 J2.2 32.33,28.8 | J1.2 38,31.34 | 38,31.34 37.57,31.34 32.64,31.34 32.51,31.22 | U13.5 58.19,13.72 v58.24,13.77 | v26.29,12.09 26.29,11.23 U4.8 | 38,31.34 v40.89,31.34
  Top 0.406: 32.33,28.8 27.23,28.8 v27.2,28.83
  Top 0.61: 15.24,2.95 15.24,7.62 16.76,9.14 16.76,13.97 17.65,14.86 20.09,14.86 20.45,14.86 21.03,15.44 21.83,15.44 v21.88,15.39 | CARD1.1 17.08,4 16.03,2.95 15.24,2.95 | 15.24,2.95 15.09,2.95 C23.A
  Bottom 0.178: 18.47,23.22 18.52,23.16 C17.1 18.48,23.11 17.96,23.11 | 16.34,23.36 16.59,23.11 17.96,23.11 | 21.51,24.41 U2.14 | 23.64,27.15 C15.1 | U11.2 35.36,21.89 35.18,22.07 35.18,23.47 34.77,23.88 34.77,24.07 R32.2 34.44,24.41 | 50.32,33.58 50.33,33.56 R4.2 50.33,31.84 50.42,31.75 56.59,31.75 | 56.59,31.75 61.87,31.75 62.33,31.29 R3.2 | v56.52,34.32 56.52,31.83 56.59,31.75 | v17.96,25.4 17.96,23.11
  Bottom 0.254: R3.2 62.32,26.8 R8.2 | C13.1 51.98,26.54 v50.65,26.54 50.65,21.64 51.18,21.11 51.82,21.11 52.2,20.73 52.2,19.89 | C20.1 50.99,18.49 v52.22,18.49 52.2,18.52 52.2,19.89 | v64.54,12.6 63.41,12.57 C1.1 63.35,12.48 63.35,11.23 63.09,10.97 59.39,10.97 59.18,11.18 59.18,12.29 58.71,12.76 58.22,12.76 C2.1 | v7.72,13.72 6.93,13.72 6.6,14.05 6.6,14.95 C25.1 | v5.84,25.81 5.99,25.91 6.78,25.91 6.81,25.86 C4.1 6.88,25.89 6.88,23.85 7.73,23 10.29,23 | 10.29,23 C5.1 | 10.29,23 v10.29,21.16 | U11.2 37.79,21.89 | 37.79,21.89 U12.1 | 37.79,21.89 37.79,19.29 U12.5 | R30.2 16.41,23.42 16.34,23.36 | R35.2 35.95,12.97 v35.56,13.36 | 42.4,14.46 42.12,14.46 41.99,14.33 41.99,15.77 | 41.99,15.77 41.99,17.6 42.67,18.29 43.64,18.29 44.53,19.18 47.47,19.18 48.13,19.84 52.15,19.84 52.2,19.89 | U7.8 42.06,15.7 41.99,15.77
  Bottom 0.305: C16.1 23.32,14.91 22.81,15.42 21.91,15.42 v21.88,15.39 | v21.88,15.39 21.76,15.27 C12.1 21.76,12.03 22.02,11.76 25.96,11.76 v26.29,12.09 26.31,12.07 C11.1 | v5.89,33.15 5.89,32.13 6.17,31.85 v12.12,31.85 22.68,31.85 22.96,32.13 | U12.5 37.84,20.21 v37.87,20.24 | C9.1 42.4,14.46 41.59,14.46 40.64,13.51 35.71,13.51 v35.56,13.36 35.51,13.41 34.06,13.41 33.68,13.79 R24.1 31.41,15.94 30.99,16.36 30.76,16.61 v30.23,17.15 | JP1.2 50.01,33.69 R4.2 50.33,29.62 | 50.33,29.62 50.33,26.86 v50.65,26.54 | C25.1 6.62,19.14 7.37,19.89 9.02,19.89 v10.29,21.16 | 22.96,32.13 v22.96,32.92 | v29.44,32.46 28.96,31.98 23.14,31.95 22.96,32.13 | 50.65,16.41 51.08,16.84 51.08,18.4 C20.1 | v52.22,18.49 52.96,19.23 55.58,19.23 56.34,18.47 56.34,15.85 56.74,15.44 58.01,15.44 58.24,15.21 v58.24,13.77 58.24,12.79 58.22,12.76 | 18.48,23.11 19.91,23.11 | 21.83,15.44 v21.88,15.39 | 23.64,27.1 C15.1 | v40.89,31.34 41.53,31.34 42.82,30.12 49.77,30.12 50.33,29.62
  Bottom 0.406: v27.2,28.83 24.16,28.83 23.62,28.3 23.62,27.17 C15.1 | 23.64,27.1 22.56,27.1 21.64,26.19 21.64,24.54 U2.14 | 21.51,24.41 20.4,24.41 19.91,23.93 19.91,23.11 19.91,16.05 20.78,15.19 21.68,15.19 v21.88,15.39
AMD
  Top 0.254: U3.7 48.2,7.66 46.05,5.51 46.05,4.05 CARD1.29
AMD_O
  Top 0.254: U1.41 59.61,24 62.56,21.06 62.56,9.86 62.81,9.6 63.45,9.6 U3.17
AUX_O
  Top 0.254: U1.32 55.04,15.75 55.5,15.29 55.5,13.13 55.83,12.8 56.71,12.8 U13.4
BOTS
  Top 0.178: U3.8 48.72,7.01 47.02,5.31 47.02,3.02 CARD1.30
BOTS_O
  Top 0.178: U1.42 59.47,24.83 63.07,21.23 63.07,10.59 63.4,10.26 U3.18
BPD
  Top 0.178: U3.2 55.84,10.91 55.68,10.74 46.74,10.74 41.02,4.98 41.02,2.97 CARD1.24
BPD-R-SET
  Bottom 0.178: U2.6 26.37,18.11 26.09,17.83 26.09,15.85 27.13,14.86 29.34,14.86 29.87,14.33 29.87,5.77 31.01,4.65 31.01,2.99 CARD1.14
BPD_O
  Top 0.254: U1.36 59.22,20.03 59.54,19.71 59.51,7.44 60.6,6.35 63.45,6.35 U3.12
BRAKE_PRESURE
  Top 0.178: CARD1.6 22.32,2 22.99,2.62 22.99,5.05 23.98,6.07 23.98,7.04 24.33,7.39 U4.5 26.29,7.37
  Top 0.305: PS.1 PS.2
  Top 0.406: U4.5 28.99,7.39 PS.2
CURRENT_SENSOR  (via drill 0.3)
  Top 0.178: CARD1.5 22,4.91 23.32,6.22 23.32,8.41 23.19,8.53 | 23.19,8.53 23.04,8.69 21.06,8.69 U4.3 19.86,8.66 19.61,8.41 19.23,8.41 19.1,8.28 19.1,7.5 CS.1 | v31.75,22.91 30.1,22.91 28.98,21.79 28.98,16.54 27.76,15.32 27.76,9.5 27.56,9.3 23.95,9.3 23.19,8.53
  Top 0.254: CS.1 CS.2
  Bottom 0.178: J2.1 35.31,27.13 34.04,25.86 32.39,25.86 32.05,25.53 32.05,23.22 v31.75,22.91
ECU
  Top 0.254: U3.9 49.16,6.36 48.03,5.23 48.03,4.03 CARD1.31
ECU_O
  Top 0.178: U1.43 59.61,25.63 63.55,21.69 63.55,11.02 63.68,10.92 U3.19
GND  (via drill 0.3, 0.5)
  Top 0.254: U6.3 38.95,9.97 38.89,9.91 38.89,8.99 38.38,8.48 D7.C
  Top 0.305: U1.29 52.64,17.41 53.04,17.81
  other vias: 11.23,27.36 1.98,28.88 5.59,20.62 12.42,17.81 3.66,12.55 12.67,8.05 32.36,6.55 37.95,7.09 41.71,8.92 2.21,17.78 1.83,2.46 48.23,14.45 41.02,15.42 46.38,17.53 21.56,5.97 26.64,13.31 17.98,13.56 58.34,9.7 55.12,11.73 49.15,25.78 55.09,20.52 63.27,23.72 62.56,33.91 51.28,30.15 42.21,26.92 36.88,27.48 29.64,30.96 30.56,15.47 20.45,25.43 28.04,27.94 24.16,37.21 16.08,35 21.79,34.95 11.56,37.52 7.14,37.08 51.94,11.94 58.12,30.71 31.78,27.53
  pour Top (rank 6): -1.27,40.77 68.48,39.67 68.45,-0.79 -0.94,-1.12 -1.22,38.28
  pour Bottom (rank 5): -0.86,41.73 66.9,41.17 67.54,-2.03 -0.61,-1.65 -0.84,40.94
IMD
  Top 0.178: U3.3 47.37,10.26 42.09,4.98 42.09,4.09 CARD1.25
IMD-R-SET
  Top 0.178: U6.4 39.07,12.8 39.34,12.8 39.8,12.34 39.8,7.87 38.33,6.4 33.5,6.4 32.08,4.98 32.08,4.08 CARD1.15
  Top 0.305: IMD.1 IMD.2 38.95,14.43 U6.4 JP2.1
IMD-SIG
  Top 0.178: CARD1.13 30,4.65 31.57,6.22 31.57,7.82 | IMDI.1 IMDI.2
  Top 0.254: 31.57,7.82 IMDI.1 32.77,7.96 R16.2 33.07,8.27 33.07,10.01 33.2,10.01 33.26,9.95 R9.2
IMD_O
  Top 0.254: U1.37 59.31,20.8 60.1,20.02 60.1,7.75 60.86,6.99 63.44,6.99 U3.13
IMD_STAT  (via drill 0.3)
  Top 0.178: v41.68,10.92 41.68,11.56 43.38,13.28 50.42,13.28 52.3,15.16 53.24,15.16 53.44,15.37 54,15.37 54.2,15.57 54.2,16.59 U1.31
  Top 0.254: R10.2 36.11,12.03
  Top 0.305: R9.1 R10.2 | 36.11,12.03 36.78,11.35 37.97,11.35 | 37.97,11.35 38.02,11.3 38.02,10.1 U6.2 | 37.97,11.35 38.06,11.44 JP2.2 38.06,11.46 v37.97,11.38
  Bottom 0.178: v37.97,11.38 38.51,10.46 41.12,10.46 v41.68,10.92
IS_O  (via drill 0.5)
  Top 0.178: U1.30 53.44,17.55 v54.1,18.21
  Top 0.305: R18.1 v47.73,11.73 R17.2
  Bottom 0.178: v54.1,18.21 54.1,11.61 53.72,11.23 47.98,11.23 v47.73,11.73
MAIN  (via drill 0.3)
  Top 0.178: MAIN.1 13.64,28.5 v13.82,28.68
  Top 0.254: U8.4 6.06,26.81 6.1,26.85 6.1,28.31 R6.2 6.09,28.3 R23.1 | MAIN.1 MAIN.2
  Top 0.305: MAIN.2 9.23,29.6 8.99,29.85 6.4,29.85 6.12,29.57 6.12,28.33 R6.2
  Bottom 0.178: v13.82,28.68 13.82,28.63 13.89,28.55 13.89,9.55 15.57,7.87 24.51,7.87 25.98,6.4 25.98,4.02 CARD1.9
N$1
  Top 0.178: SJ1.1 57.43,36.78 57.73,36.47 57.73,33.83 58.29,33.27 59.1,33.27 U14.1
N$2
  Top 0.305: CARD1.23 40,5.08 44.68,9.8 44.68,11.49 R18.2
N$3  (via drill 0.3, 0.5)
  Top 0.178: U16.4 10.71,20.13 10.34,19.76 10.34,19.33 v10.16,19.15
  Top 0.406: v8.79,37.64 POT2.2
  Bottom 0.178: v10.16,19.15 10.16,19.18 10.64,19.66 12.7,19.66 12.9,19.86 12.9,26.95 11.15,28.7 5.26,28.7 3.99,29.97 3.99,32.11 3.63,32.46 2.54,32.46 1.73,33.27 1.73,37.77 2.18,38.23 8.23,38.23 v8.79,37.64
  Bottom 0.406: C26.1 8.76,37.62 v8.79,37.64
N$4  (via drill 0.3)
  Top 0.406: v14.66,37.77 POT5.2
  Bottom 0.178: 33.69,20.9 U11.4
  Bottom 0.305: C8.1 14.63,37.77 14.99,38 27.51,38 28.5,37.24 28.5,34.9 29.01,34.39 30.18,34.39 30.66,33.81 30.66,20.97 SP.1 SP.2 33.69,20.9
  Bottom 0.406: C8.1 v14.66,37.77
N$5
  Top 0.305: R21.1 3.19,16.6 3.33,16.74 3.33,18.16 Q1.1
N$6
  Top 0.305: Q1.2 R5.1
N$7  (via drill 0.3)
  Top 0.178: U18.10 23.06,24.21 23.29,23.98 23.29,18.59 23.72,18.16 24.79,18.16 v24.99,17.96
  Bottom 0.178: v24.99,17.96 25.43,17.96 26.52,18.92 27.05,18.92 27.15,19.05 U2.5
N$8  (via drill 0.6)
  Top 0.254: v64.52,28.52 64.54,29.85 D9.A
  Bottom 0.254: R3.1 64.45,30.12 64.55,30 64.55,28.62 v64.52,28.52
N$9  (via drill 0.6)
  Top 0.254: v64.24,25.27 64.24,26.56 D8.A
  Bottom 0.254: R8.1 64.21,26.72 64.24,26.47 v64.24,25.27
N$10  (via drill 0.3)
  Top 0.178: U5.4 16.78,26.4 v16.62,26.53
  Bottom 0.178: 16.41,25.16 16.41,25.27 16.41,26.26 v16.62,26.53 17.53,26.54 17.88,26.7 17.96,26.77 17.9,26.77 R31.2
  Bottom 0.254: R30.1 16.41,25.27
N$11  (via drill 0.3)
  Top 0.178: U10.4 8.97,13.52 v9.22,13.77 | v3.38,34.77 3.38,35.99 3.3,36.07 3.3,36.22 POT1.2
  Bottom 0.178: v9.22,13.77 10.26,13.77 10.57,14.07 10.57,18.14 11.4,18.97 13.11,18.97 13.36,19.23 13.36,27.15 11.35,29.16 5.38,29.16 4.65,29.9 4.65,32.51 3.38,33.78 v3.38,34.77 | v3.38,34.77 3.38,35.47 | 3.38,35.47 3.39,35.46 | 3.38,35.47 3.38,36.26 C14.1 v3.37,34.78 v3.38,34.77
N$12
  Top 0.178: R16.1 34.67,8.36 | 34.67,8.36 34.72,8.2 34.9,8.2 34.95,8.36 | 34.95,8.36 35,8.13 | 34.95,8.36 D7.A 34.67,8.36
N$13  (via drill 0.3)
  Top 0.178: v24.08,23.47 24.08,25.02 24.38,25.32 25.83,25.32 26.21,24.94 26.21,24.31 26.31,24.21 U18.7 | U9.4 21.99,14.39 22.81,15.21 22.81,16.15 v23.55,16.89
  Bottom 0.178: v23.55,16.89 23.55,22.94 v24.08,23.47
N$14
  Top 0.178: 27.2,22.96 27.23,22.94 U18.6 28.88,22.94 29.03,23.09 R15.1 30.72,23.66 31.42,24.36 31.42,26.06 31.93,26.57 40.31,26.57 40.77,27.03 40.77,28.91 J1.1
N$16
  Top 0.178: R19.1 D1.A
N$17  (via drill 0.5)
  Top 0.178: U18.5 25.76,21.67 25.43,22 25.43,24.41 v25.37,24.46
  Bottom 0.178: v25.37,24.46 U2.1
N$18  (via drill 0.5)
  Top 0.178: v24.82,20.9 24.82,20.6 25.04,20.45 27,20.45 27,20.4 U18.4
  Bottom 0.178: U2.2 25.45,23.19 25.12,22.86 25.12,21.11 v24.82,20.9
N$19  (via drill 0.5)
  Top 0.178: U18.3 25.91,19.13 v25.53,19.48
  Bottom 0.178: v25.53,19.48 25.53,20.29 25.91,20.68 27.13,20.68 U2.4
N$20
  Top 0.178: R19.2 45.52,17.98 U1.22
N$21
  Top 0.178: R29.2 16.43,22.1 16.56,22.23 18.08,22.23 18.42,22.56 18.42,24.74 18.69,25.02 19.37,25.04 U5.3
N$22
  Top 0.178: U18.9 21.66,26.85 21.51,27 20.97,27 CLK.2 CLK.1 19.15,27.05 18.77,27.43 17.22,27.43 17.02,27.23 16.08,27.23 15.77,26.92 15.77,23.27 15.93,23.11 16.56,23.11 16.64,23.04 16.97,23.04 17.07,23.14 16.8,23.14 U5.6
N$23  (via drill 0.3, 0.5)
  Top 0.178: CSP.2 24.88,30.44 25.93,31.5 25.93,34.09 v25.93,34.11 25.93,36.14 POT4.2 | CSP.1 21.16,30.18 21.44,30.45 22.38,30.45 v22.48,30.35 | v22.99,10.06 21.16,10.06 U4.2
  Top 0.254: CSP.2 CSP.1
  Top 0.406: 26.01,36.73 26.01,36.22 POT4.2
  Bottom 0.178: v22.48,30.35 22.48,29.95 22.1,29.57 16.81,29.57 15.39,28.14 15.39,10.57 16.13,9.83 22.76,9.83 v22.99,10.06 | C3.1 26.01,34.19 v25.93,34.11
N$24
  Bottom 0.254: U11.1 38.57,22.84 38.81,22.61 38.81,21.65 U12.2
  Bottom 0.406: U11.1 36.33,24.31 R32.1 37.48,24.38 R25.2
N$25
  Top 0.178: R11.1 19.71,21.22 R12.2 | 19.47,21.46 R12.2 | U5.1 19.62,23.13 19.66,23.09 19.66,21.27 R12.2
N$26  (via drill 0.3)
  Top 0.178: PSP.2 19.86,30.76 20.17,31.06 v20.17,33.99 20.17,34.39 20.17,36.25 POT3.2 | U4.6 28.04,8.66 28.19,8.81 28.19,14.68 v29.29,15.77 | v14.53,30.76 PSP.1
  Top 0.305: PSP.1 PSP.2
  Top 0.406: 20.19,36.32 POT3.2
  Bottom 0.178: v29.29,15.77 29.29,30.07 28.02,31.34 15.11,31.34 v14.53,30.76 | C18.1 20.14,34.01 v20.17,33.99
N$27
  Top 0.305: R20.1 2.51,10.12 D2.A
N$28
  Top 0.178: R14.2 20.89,11.06 U4.1 | U9.1 23.1,11.49 22.86,11.25 21.44,11.25 21.41,11.28
  Top 0.254: 21.88,11.54 21.62,11.28 21.41,11.28 21.11,11.28 U4.1
N$29
  Top 0.178: D6.A 39.26,21.56 R26.1
N$30
  Top 0.178: U9.2 23.88,13.74 24.26,13.36 | 24.26,13.36 24.26,11.56 24.33,11.48 | R13.2 24.86,13.68 24.51,13.34 24.28,13.34 24.26,13.36
  Top 0.254: U4.7 24.74,9.93 24.36,10.31 24.36,11.46 24.33,11.48
N$31
  Bottom 0.254: Q2.1 30.7,12.89 30.94,12.65 33.71,12.65 34.14,12.22 34.14,10.77 34.11,10.74 34.11,10.53 R35.1
N$32
  Bottom 0.254: R36.1 32.4,15.03 32.64,14.78 32.64,13.66 Q2.2
N$33
  Top 0.305: D3.A 7.61,7.8 R1.1
N$34
  Bottom 0.178: 33.59,17.83 R24.2
  Bottom 0.254: R36.2 32.13,17.48 32.49,17.83 33.59,17.83
  Bottom 0.305: R24.2 33.66,17.77 33.66,19.05 34.01,19.41 RSTT.1 34.61,19.51 34.75,19.51 34.85,19.41 RSTT.2 36.09,19.41 35.97,19.28 C7.1
  Bottom 0.406: U11.3 36.33,19.65 RSTT.2
N$40
  Top 0.178: JP1.4 44.93,28.52 45.59,27.86 46.66,27.86 47.57,26.95 47.57,23.19 46.81,22.43 U1.17
N$43
  Top 0.178: JP1.5 42.39,34.39 42.9,33.88 43.99,33.88 44.45,33.43 44.45,28.3 45.47,27.28 46.61,27.28 47.17,26.72 47.17,23.52 46.86,23.22 U1.16
N$46  (via drill 0.3)
  Top 0.178: SJ1.2 52.86,36.78 JP1.1 52.81,36.22 52.81,32.82 52.32,32.33 v48.36,32.33 | U1.18 44.31,21.63 43.97,22.07 43.97,32.21 v43.31,32.87
  Bottom 0.178: v43.31,32.87 47.83,32.87 v48.36,32.33
  Bottom 0.305: JP1.1 52.55,33.8 R4.1
N$59
  Top 0.254: R5.2 8.76,18.19 8.97,18.39 8.97,20.01 U16.3
  Top 0.305: C6.1 11.07,15.9 10.52,16.46 8.9,16.46 R2.2 8.75,16.41 R5.2
N$62
  Top 0.178: 7.62,23.38 7.62,21.93 DLY.2
  Top 0.254: DLY.1 DLY.2 | 9.03,23.37 R7.1 7.62,23.38 7.62,23.95 7.24,24.33 7.24,25.7 7.39,25.86 U8.2 | 9.03,23.37 R22.1 | 9.03,23.37 9.03,22.09 U16.1
N$63
  Top 0.254: D4.A 2.64,27.9 R23.2
N$67
  Top 0.254: D5.A 10.9,23.44 R22.2
RELAY-SET  (via drill 0.3)
  Top 0.178: R26.2 41.08,16.67 40.54,16.13 40.31,16.13 v40.26,16.18 40.26,7.67 38.46,5.87 33.81,5.87 32.99,5.05 32.99,2.84 32.15,2 CARD1.16
  Bottom 0.178: R33.2 41.28,18.97 41.17,18.87 39.88,18.87 | 39.88,18.87 U12.4 | STMR.2 STMR.1 | 39.88,18.87 39.88,17.6 STMR.2 | v40.26,16.18 40.26,16.83 STMR.2
RS-A
  Bottom 0.178: CARD1.20 36.59,2 37.01,2.41 37.01,5.03 37.34,5.36 42.34,5.36 44.73,7.75 44.73,10.67 45.77,11.71 45.77,12.66 R34.1
  Bottom 0.305: U7.6 45.72,12.71 R34.1
RS-B
  Bottom 0.178: CARD1.19 36,5.06 36.8,5.87 42.09,5.87 44.04,7.82 44.04,12.59 R34.2
  Bottom 0.305: U7.7 44.45,13.17 R34.2
RTG  (via drill 0.3)
  Top 0.178: v15.21,9.53 9.46,9.53 R27.2
  Top 0.305: R1.2 R27.2
  Bottom 0.178: CARD1.11 28,5.4 24.87,8.53 16.21,8.53 v15.21,9.53
RTG_5V  (via drill 0.3, 0.5)
  Top 0.178: U1.23 47.84,20.08 48.41,20.65 49.68,20.65 v49.83,20.8 | v31.57,30.53 31.19,30.53 30.28,29.62 23.44,29.62 v22.48,28.65 | v16.38,27.94 15.32,27.94 14.53,27.15 14.53,11.2 13.79,10.46 7.85,10.46 7.65,10.26 7.65,9.51 R27.1
  Top 0.254: R28.2 7.34,11.38 7.32,11.35
  Top 0.305: R27.1 6.41,9.5 RG.1 RG.2 | R28.2 6.47,11.38 RG.2 | U10.3 6.37,11.28 RG.2
  Bottom 0.178: v49.83,20.8 50.04,21.01 50.04,24.46 49.71,24.79 44.5,24.79 43.82,25.48 43.82,28.32 41.61,30.53 v31.57,30.53 | v22.48,28.65 17.09,28.65 v16.38,27.94
RX1  (via drill 0.3)
  Top 0.178: v49.2,23.77 54.2,23.77 54.76,24.33 54.76,25.83 55.85,26.92 U1.1
  Top 0.254: D9.C RX.2 RX.1 59.46,29.93 59.46,28.75 58.94,28.23 U1.1
  Bottom 0.178: v49.2,23.77 49.17,23.8 47.93,23.8 47.47,23.34 44.15,23.34 43.21,22.4 43.21,21.31 43,21.11 43,20.88 43.03,20.85 43.1,20.85 U7.1
SSW_C
  Top 0.178: U3.4 47.58,9.61 42.98,5 42.98,2.98 CARD1.26
SSW_C_O
  Top 0.254: U1.38 59.32,21.6 60.71,20.22 60.71,8.08 61.11,7.67 63.45,7.67 U3.14
SSW_L
  Top 0.178: U3.6 48.01,8.31 45.01,5.31 45.01,3.01 CARD1.28
SSW_L_O
  Top 0.254: U1.40 59.45,23.2 61.87,20.78 61.87,9.17 62.08,8.97 63.46,8.97 U3.16
SSW_R
  Top 0.254: U3.5 47.75,8.96 44.09,5.31 44.09,4.09 CARD1.27
SSW_R_O
  Top 0.254: U1.39 59.39,22.4 61.29,20.5 61.29,8.53 61.52,8.31 63.46,8.31 U3.15
START  (via drill 0.3, 0.5)
  Top 0.178: R20.2 2.5,13.31 1.45,13.31 1.14,13 1.14,5.05 1.7,4.5 v2.31,4.5 | CARD1.10 25.79,2 24.99,2.79 24.99,5.18 v24.89,5.28
  Top 0.254: R2.1 7,16.47 6.96,16.51
  Top 0.305: R2.1 6.65,16.36 6.43,16.13 6.43,15.9 | R20.2 2.51,14.34 R21.2 3,14.77 U10.1 6.43,14.82 6.43,15.9 | SRT.1 SRT.2 | 6.96,16.51 4.83,16.51 4.5,16.84 4.5,16.87 4.29,17.07 4.29,18.8 3.86,19.23 2.31,19.23 2.13,19.41 2.13,21.75 SRT.1 | U8.1 9.82,24.91 v10.01,25.1 | v1.4,21.97 1.94,21.97 SRT.1 | 6.43,15.9 6.83,16.31
  Bottom 0.178: v24.89,5.28 3.1,5.28 v2.31,4.5
  Bottom 0.305: v10.01,25.1 10.01,27.41 9.3,28.12 4.85,28.12 4.65,27.91 4.65,22.28 4.37,22 1.45,22 v1.4,21.97
TSMS
  Top 0.178: U13.1 52.54,14.67 51.64,13.77 51.64,12.95 51.49,12.8 43.61,12.8 42.8,11.99 42.8,8.64 38.99,4.85 38.99,3.04 CARD1.22
TSMS_O
  Top 0.254: U13.6 56.75,17.5 56.11,18.14 56.11,19.02 56.34,19.25 57.62,19.25 U1.35
TX1  (via drill 0.3)
  Top 0.178: v49.3,22.43 55.22,22.43 55.85,23.06 55.85,25.73 56.52,26.39 57.6,26.39 U1.44
  Top 0.254: D8.C 61.38,26.77 TX.2 TX.1 59.23,26.43 U1.44
  Bottom 0.178: v49.3,22.43 49,22.12 47.4,22.12 47.02,21.74 47.02,20.96 U7.4
U7-RE/DE  (via drill 0.3)
  Top 0.178: v48.23,22.83 48.23,24.13 48.77,24.66 53.8,24.66 54.13,24.99 54.13,26.06 55.02,26.95 55.02,28.2 U1.2
  Top 0.254: U1.2 55.04,29.7 RD.1 RD.2
  Bottom 0.178: U7.2 U7.3 45.72,22.17 46.3,22.76 48.16,22.76 v48.23,22.83
WDT  (via drill 0.3)
  Top 0.178: U1.19 43.69,20.83 43.48,21.03 43.48,31.04 v42.93,31.6 | v48.18,31.14 54.48,31.14 55.12,31.78 55.12,34.93 55.42,35.23 56.55,35.23 U14.4
  Bottom 0.178: v42.93,31.6 47.73,31.6 v48.18,31.14

### Text on the board
tPlace: + | C-SET | P-SET | TRIP | T-SET | R-SET | CF | LR | BSPD | PRE_CG | IMD | University of Akron | Safety System | "SS"